# EasyEDA schematic SCH_PCB_LAMOS_Moteur_2025-04-08.json
TITLE: Electronique de larguage temporel - LAMOS SURFACE; REV: 1.1; Date: 2025-03-03; Sheet: 1/1; Company: Open Source Oceanography
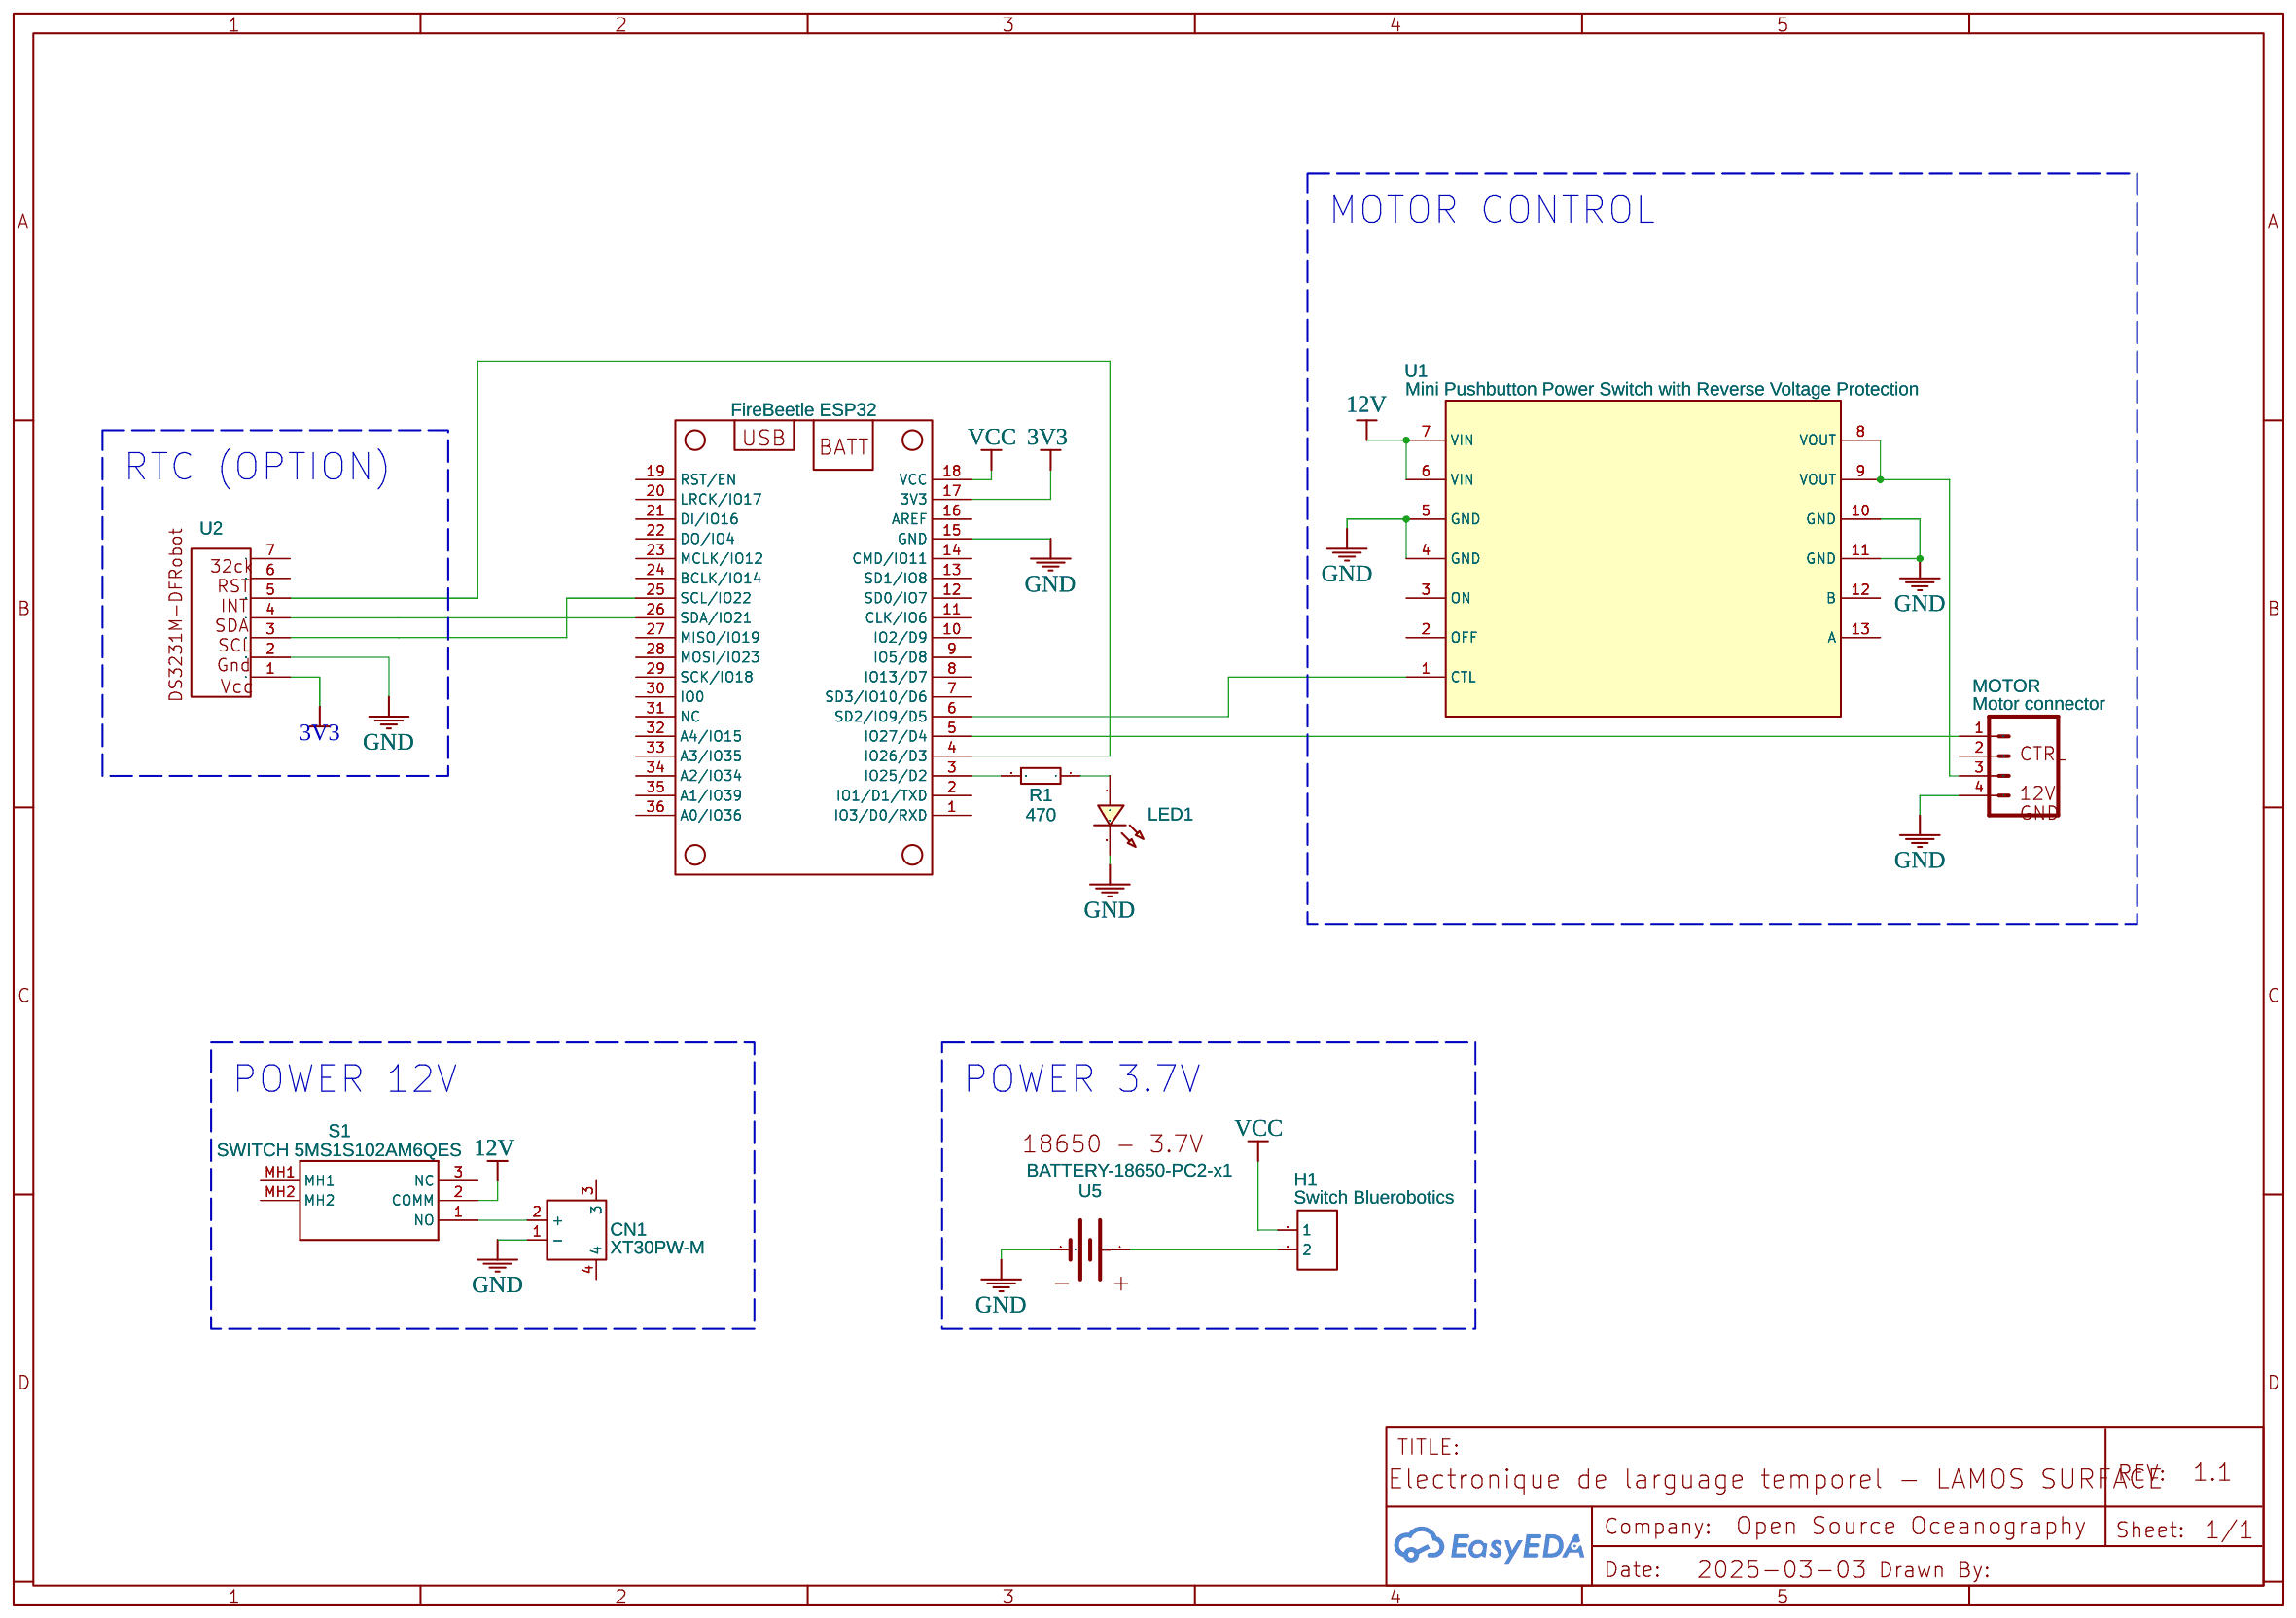
[diagram p0: schematic sheet]

## Parts
CN1  XT30PW-M  [CONN-TH_XT30PW-M]
ESP32-FB  FireBeetle ESP32  [FIREBEETLE ESP32_V1.0]
H1  Switch Bluerobotics  [HDR-F-2.54_1X2]
LED1  LED-TH-3mm_G  [LED-TH_BD3.0_GREEN]
MOTOR  Motor connector  [1X04]
R1  470  [AXIAL-0.3]
S1  SWITCH 5MS1S102AM6QES  [5MS1S102AM6QES]
U1  Mini Pushbutton Power Switch with Reverse Voltage Protection  [MINI PUSHBUTTON POWER SWITCH WITH REVERSE VOLTAGE PROTECTION]
U2  DS3231_DFRobot  [DFROBOT RTC3231]
U5  BATTERY-18650-PC2-x1  [BATTERY-HOLDER-18650-PC2-X1]

## Library data of the parts
CN1 = XT30PW-M: Contributor: LCSC; Supplier: LCSC; Supplier Part: C431092; Manufacturer: AMASS(艾迈斯); Manufacturer Part: XT30PW-M30.G.Y; JLCPCB Part Class: Extended Part
ESP32-FB = -: sourceId: 0S0UN5Zhz; Manufacturer Part: ?
H1 = HDR-F-2.54_1x2: Supplier Part: C49661; Supplier: LCSC; Contributor: LCEDA_Lib
LED1 = LED-TH-3mm_G: Manufacturer: EVERLIGHT(台湾亿光); Manufacturer Part: 204-10SYGD/S530-E3; Supplier Part: C85161; Contributor: LCEDA_Lib
MOTOR = -: SparkFun has standardized on a pinout for all I2C based sensor breakouts.; Contributor: SparkFun; Manufacturer Part: ?; Package Display: No
R1 = Res_AXIAL-0.3(1/8W)_EU: Manufacturer Part: ?
S1 = 5MS1S102AM6QES: Contributor: thiebaut.benjamin
U1 = Mini Pushbutton Power Switch with Reverse Voltage Protection: Contributor: winter2015; sourceId: YsmgyP7pj
U2 = DS3231_DFRobot: Manufacturer: DFROBOT; Manufacturer Part: DS3231M MEMS; Contributor: CedricC
U5 = BATTERY-18650-PC2-x1: Supplier: LetMeKnow; Contributor: CedricC

## Nets
3V3: ESP32-FB.17(3V3) U2.1
12V: S1.2(COMM) U1.6(VIN) U1.7(VIN)
GND: CN1.1(-) ESP32-FB.15(GND) LED1.2 MOTOR.4 U1.4(GND) U1.5(GND) U1.10(GND) U1.11(GND) U2.2 U5.2(-)
VCC: ESP32-FB.18(VCC) H1.1
Net-(CN1-2): CN1.2(+) S1.1(NO)
Net-(ESP32-FB-3): ESP32-FB.3(IO25/D2) R1.2
Net-(ESP32-FB-4): ESP32-FB.4(IO26/D3) U2.5
Net-(ESP32-FB-5): ESP32-FB.5(IO27/D4) MOTOR.1
Net-(ESP32-FB-6): ESP32-FB.6(SD2/IO9/D5) U1.1(CTL)
Net-(ESP32-FB-25): ESP32-FB.25(SCL/IO22) U2.3
Net-(ESP32-FB-26): ESP32-FB.26(SDA/IO21) U2.4
Net-(H1-2): H1.2 U5.1(+)
Net-(LED1-1): LED1.1 R1.1
Net-(MOTOR-3): MOTOR.3 U1.8(VOUT) U1.9(VOUT)

Not connected (* = marked no-connect by the designer): CN1 3 4; ESP32-FB 1(IO3/D0/RXD) 2(IO1/D1/TXD) 7(SD3/IO10/D6) 8(IO13/D7) 9(IO5/D8) 10(IO2/D9) 11(CLK/IO6) 12(SD0/IO7) 13(SD1/IO8) 14(CMD/IO11) 16(AREF) 19(RST/EN) 20(LRCK/IO17) 21(DI/IO16) 22(DO/IO4) 23(MCLK/IO12) 24(BCLK/IO14) 27(MISO/IO19) 28(MOSI/IO23) 29(SCK/IO18) 30(IO0) 31(NC) 32(A4/IO15) 33(A3/IO35) 34(A2/IO34) 35(A1/IO39) 36(A0/IO36); MOTOR 2; S1 3(NC) MH1 MH2; U1 2(OFF) 3(ON) 12(B) 13(A); U2 6 7

## Notes on the sheet
- MOTOR CONTROL
- RTC (OPTION)
- POWER 12V
- POWER 3.7V
